# EAGLE design Interfacev2 (EAGLE 7.6.0)

## Sheet 1 of 3
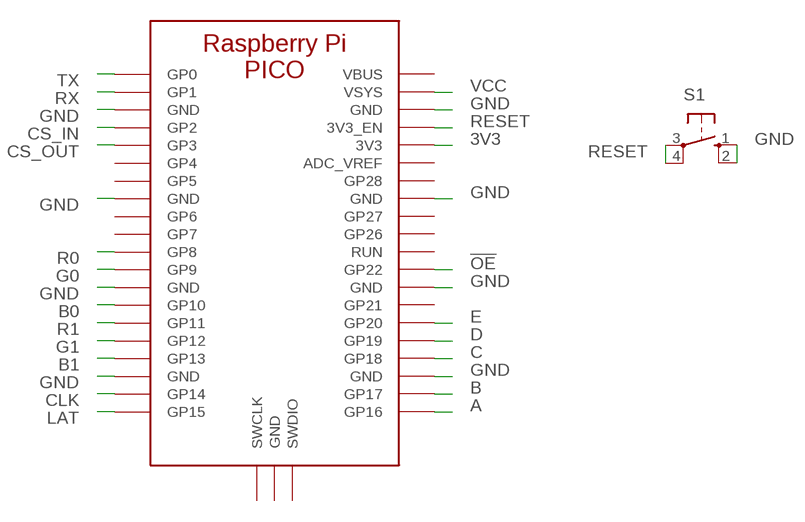
[diagram p0: schematic, sheet 1]

### Parts
S1  10-XX  [B3F-10XX]
U$1  PICO  [PICO]

### Nets
3V3: U$1.P$3V3(3V3) ; also sheet 2
!OE: U$1.P$GP22(GP22) ; also sheet 3
A: U$1.P$GP16(GP16) ; also sheet 3
B: U$1.P$GP17(GP17) ; also sheet 3
B0: U$1.P$GP10(GP10) ; also sheet 3
B1: U$1.P$GP13(GP13) ; also sheet 3
C: U$1.P$GP18(GP18) ; also sheet 3
CLK: U$1.P$GP14(GP14) ; also sheet 3
CS_IN: U$1.P$GP2(GP2) ; also sheet 2
CS_OUT: U$1.P$GP3(GP3) ; also sheet 2
D: U$1.P$GP19(GP19) ; also sheet 3
E: U$1.P$GP20(GP20) ; also sheet 3
G0: U$1.P$GP9(GP9) ; also sheet 3
G1: U$1.P$GP12(GP12) ; also sheet 3
GND: S1.1(S) S1.2(S1) U$1.P$GND3(GND) U$1.P$GND8(GND) U$1.P$GND13(GND) U$1.P$GND18(GND) U$1.P$GND23(GND) U$1.P$GND28(GND) U$1.P$GND33(GND) U$1.P$GND38(GND) ; also sheet 2,3
LAT: U$1.P$GP15(GP15) ; also sheet 3
R0: U$1.P$GP8(GP8) ; also sheet 3
R1: U$1.P$GP11(GP11) ; also sheet 3
RESET: S1.3(P) S1.4(P1) U$1.P$3V3_EN(3V3_EN)
RX: U$1.P$GP1(GP1) ; also sheet 2
TX: U$1.P$GP0(GP0) ; also sheet 2
VCC: U$1.P$VSYNC(VSYS) ; also sheet 3
Unconnected: U$1.P$GP4(GP4) U$1.P$GP5(GP5) U$1.P$GP6(GP6) U$1.P$GP7(GP7) U$1.P$GP21(GP21) U$1.P$GP26(GP26) U$1.P$GP27(GP27) U$1.P$GP28(GP28) U$1.P$RUN(RUN) U$1.P$SWCLK(SWCLK) U$1.P$SWDIO(SWDIO)

## Sheet 2 of 3
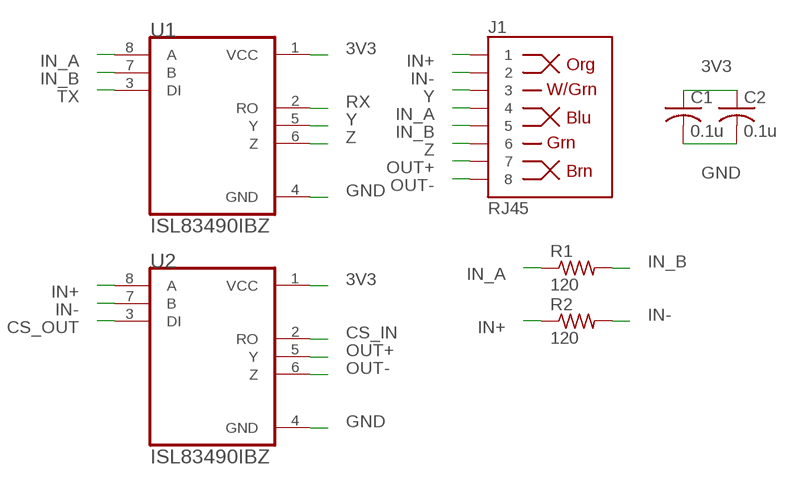
[diagram p1: schematic, sheet 2]

### Parts
C1  0.1u  C-USC0603  [C0603]
C2  0.1u  C-USC0603  [C0603]
J1  RJ45  RJ45-8PTH  [RJ45-8]
R1  120  R-US_R0603  [R0603]
R2  120  R-US_R0603  [R0603]
U1  ISL83490IBZ  [SOIC127P600X175-8N]
U2  ISL83490IBZ  [SOIC127P600X175-8N]

### Nets
3V3: C1.1 C2.1 U1.1(VCC) U2.1(VCC) ; also sheet 1
CS_IN: U2.2(RO) ; also sheet 1
CS_OUT: U2.3(DI) ; also sheet 1
GND: C1.2 C2.2 U1.4(GND) U2.4(GND) ; also sheet 1,3
IN+: J1.1 R2.1 U2.8(A)
IN-: J1.2 R2.2 U2.7(B)
IN_A: J1.4 R1.1 U1.8(A)
IN_B: J1.5 R1.2 U1.7(B)
OUT+: J1.7 U2.5(Y)
OUT-: J1.8 U2.6(Z)
RX: U1.2(RO) ; also sheet 1
TX: U1.3(DI) ; also sheet 1
Y: J1.3 U1.5(Y)
Z: J1.6 U1.6(Z)

## Sheet 3 of 3
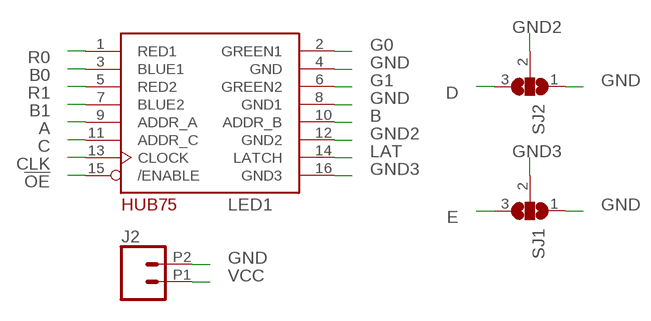
[diagram p2: schematic, sheet 3]

### Parts
J2  CONN_022.54MM_SCREWTERM  [1X02_2.54_SCREWTERM]
LED1  HUB75MATRIX  [2X08-IDC]
SJ1  SJ2W  [SJ_2]
SJ2  SJ2W  [SJ_2]

### Nets
!OE: LED1.15(/ENABLE) ; also sheet 1
A: LED1.9(ADDR_A) ; also sheet 1
B: LED1.10(ADDR_B) ; also sheet 1
B0: LED1.3(BLUE1) ; also sheet 1
B1: LED1.7(BLUE2) ; also sheet 1
C: LED1.11(ADDR_C) ; also sheet 1
CLK: LED1.13(CLOCK) ; also sheet 1
D: SJ2.3 ; also sheet 1
E: SJ1.3 ; also sheet 1
G0: LED1.2(GREEN1) ; also sheet 1
G1: LED1.6(GREEN2) ; also sheet 1
GND: J2.P2 LED1.4(GND) LED1.8(GND1) SJ1.1 SJ2.1 ; also sheet 1,2
GND2: LED1.12(GND2) SJ2.2
GND3: LED1.16(GND3) SJ1.2
LAT: LED1.14(LATCH) ; also sheet 1
R0: LED1.1(RED1) ; also sheet 1
R1: LED1.5(RED2) ; also sheet 1
VCC: J2.P1 ; also sheet 1

## Power pins joined to a net without a drawn wire
ADC_VREF: U$1.P$ADC_VREF(ADC_VREF)
GND: U$1.P$GND(GND)
VBUS: U$1.P$VBUS(VBUS)

## Library data of the parts
C1 C2 = rcl:C-US: CAPACITOR, American symbol
J1 = SparkFun-Connectors:RJ45-8: RJ45 Jack Simple RJ45, 8-pin connection - connector for common Cat5, Cat5e, and Cat6 Ethernet cables. Footprint not yet proven in production. Connector sku is PRT-00643; Breakout PCB sku is BOB-00716.; PROD_ID: CONN-08506
J2 = SparkFun-Connectors:CONN_02: Multi connection point. Often used as Generic Header-pin footprint for 0.1 inch spaced/style header connections On any of the 0.1 inch spaced packages, you can populate with these: Break Away Headers - Straight <https://www.sparkfun.com/products/116> (PRT-00116) Break Away Male Headers - Right Angle <https://www.sparkfun.com/products/553> (PRT-00553) Female Headers <https://www.sparkfun.com/products/115> (PRT-00115) Break Away Headers - Machine Pin <https://www.sparkfun.com/products/117> (PRT-00117) Break Away Female Headers - Swiss Machine Pin <https://www.sparkfun.com/products/743> (PRT-00743) For SCREWTERMINALS and SPRING TERMINALS visit here: Screw Terimnals on SparkFun.com <https://www.sparkfun.com/search/results?term=Screw+Terminals> (5mm/3.5mm/2.54mm spacing) This device is also useful as a general connection point to wire up your design to another part of your project. Our various solder wires solder well into these plated through hole pads. Hook-Up Wire - Assortment (Stranded, 22 AWG) <https://www.sparkfun.com/products/11375> (PRT-11375) Hook-Up Wire - Assortment (Solid Core, 22 AWG) <https://www.sparkfun.com/products/11367> (PRT-11367) View the entire wire category on our website here <https://www.sparkfun.com/categories/141> Special notes: Molex polarized connector foot print use with: PRT-08233 with associated crimp pins and housings. 2.54_SCREWTERM for use with PRT-10571. 3.5mm Screw Terminal footprints for PRT-08084 5mm Screw Terminal footprints for use with PRT-08432
LED1 = adafruit:HUB75MATRIX
R1 R2 = rcl:R-US_: RESISTOR, American symbol
S1 = switch-omron:10-XX: OMRON SWITCH; MPN: B3F-1000; OC_FARNELL: 176432; OC_NEWARK: 36M3542
SJ1 SJ2 = jumper:SJ2W: SMD solder JUMPER
U1 U2 = ISL83490IBZ:ISL83490IBZ: None; DESCRIPTION: ISL83490 Series 3.6 V 10 Mbps Low Power High Speed RS-485/RS-422 Transceiver; DIGI-KEY_PART_NUMBER: ISL83490IBZ-TCT-ND; DIGI-KEY_PURCHASE_URL: https://www.digikey.com/product-detail/en/renesas-electronics-america-inc/ISL83490IBZ-T/ISL83490IBZ-TCT-ND/3603227?utm_source=snapeda&utm_medium=aggregator&utm_campaign=symbol; MF: Renesas Electronics; MP: ISL83490IBZ-T; PACKAGE: SOIC-8 Intersil
U$1 = Raspberry_Pi_Pico:PICO

## Board
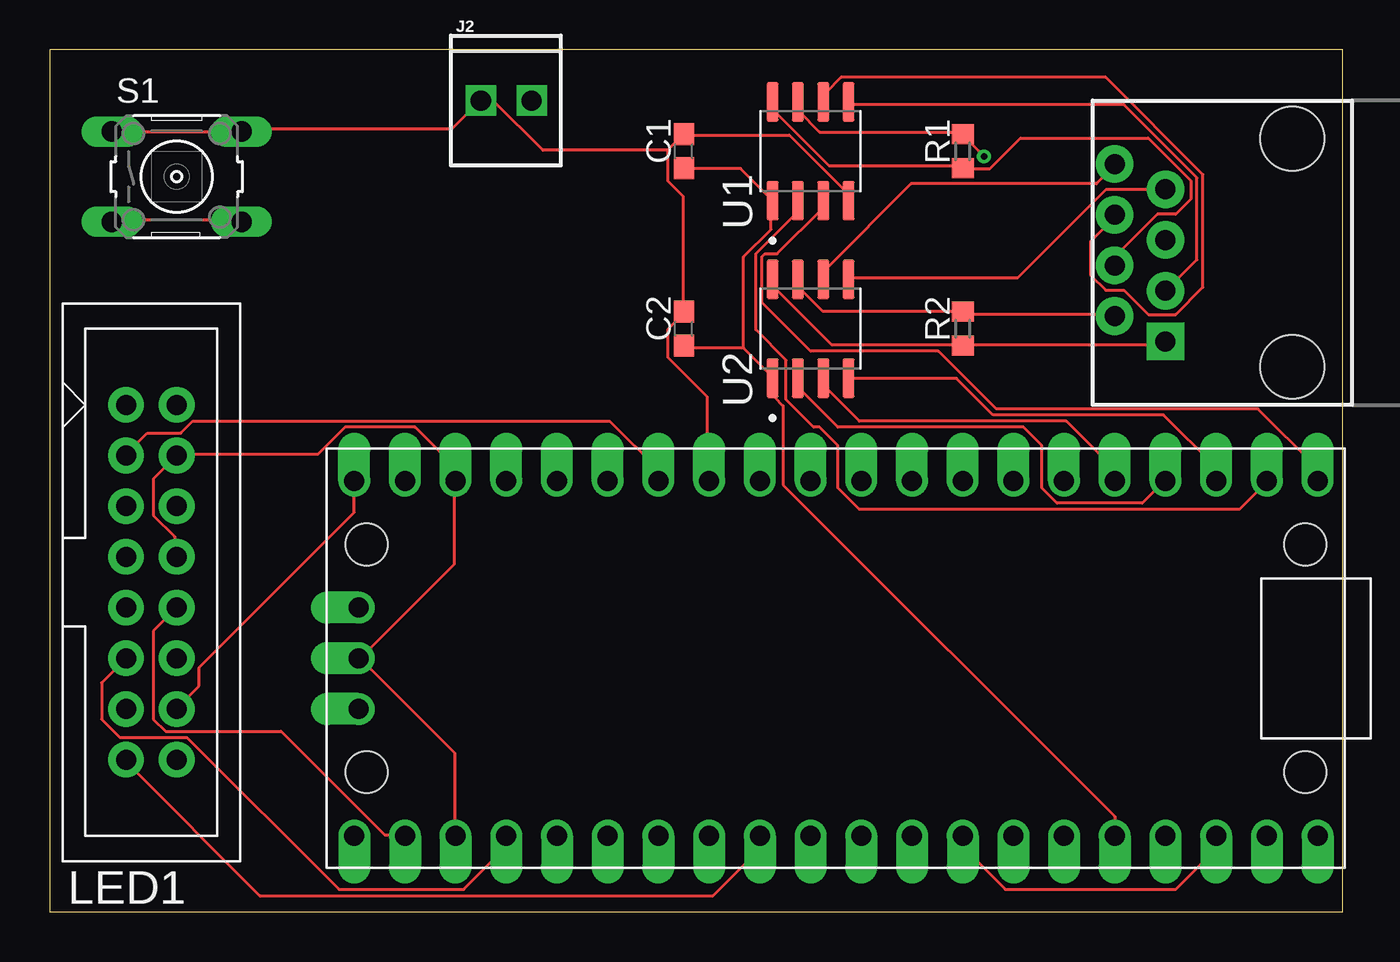
[diagram p3: board, top side]
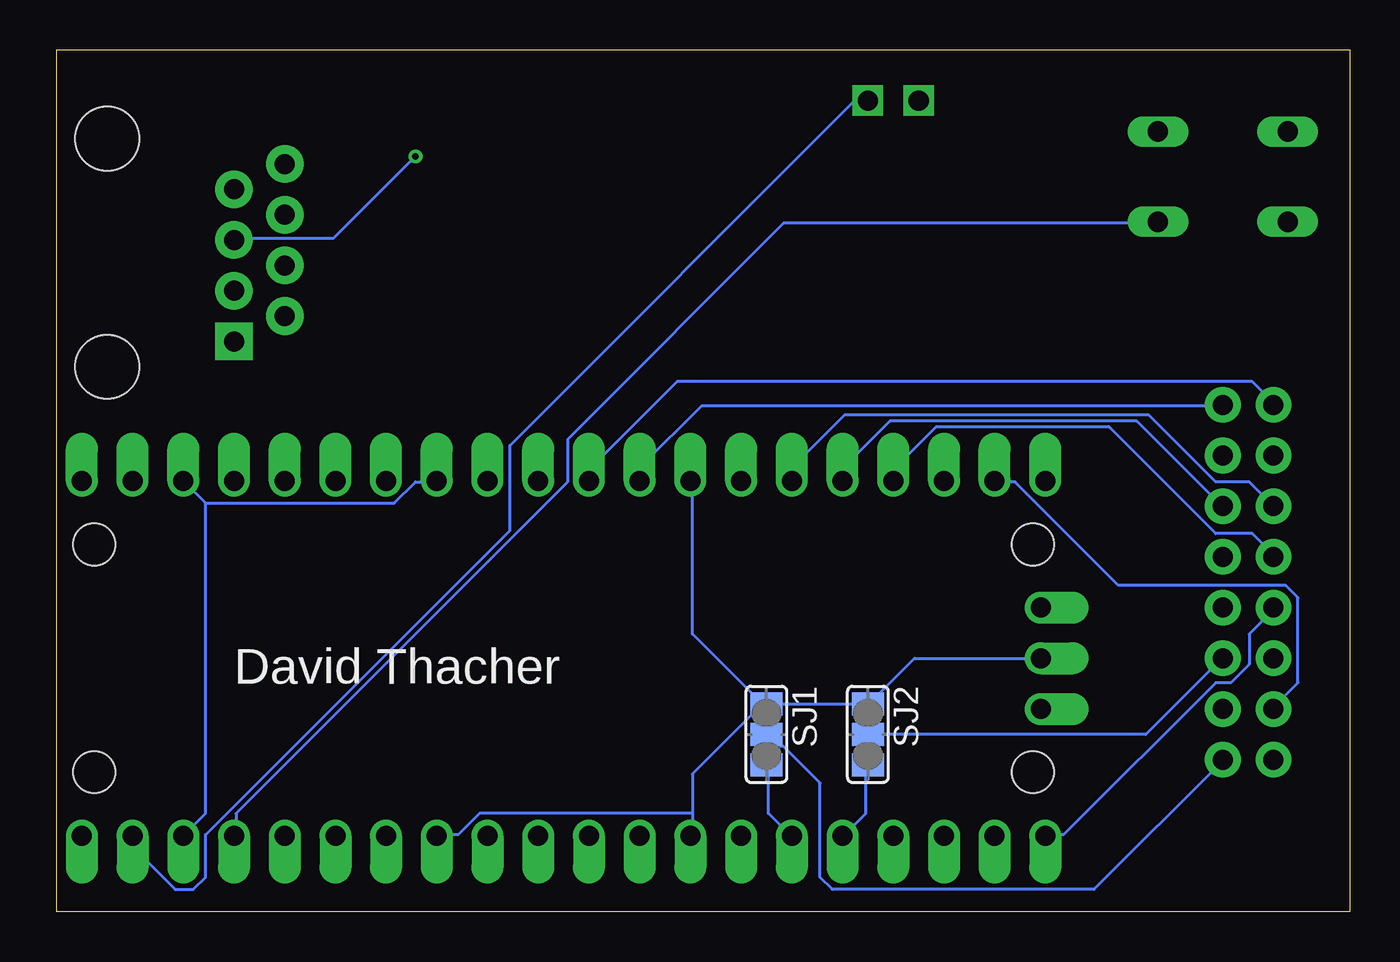
[diagram p4: board, bottom side, seen from below]

Size 64.77 x 43.18 mm. Coordinates in mm from the lower left corner, seen from the top.
Outline: 0,0 64.77,0 64.77,43.18 0,43.18 0,0
Copper layers (1*16): Top 0.0356mm / dielectric 1.5011mm / Bottom 0.0356mm
Design rules "oshpark-2layer": minimum track width 6mil, minimum drill 13mil, track to track 6mil, track to pad 6mil, pad to pad 6mil, via to via 6mil, smd to smd 6mil, copper to edge 15mil, drill to drill 6mil, minimum pad ring 7mil, minimum via ring 7mil, stop-mask expansion 2.5mil, vias tented up to drill 0mil, thermal gap 10mil

### Footprints (pad centres in the part's own frame; a part is rotated, then mirrored left to right if it is on the bottom)
C0603 = smd 1.1 x 1: 1 -0.85,0; 2 0.85,0
RJ45-8 = drill 1 pad 1.88 square: 1 -4.445,6.35 | drill 1 pad 1.88: 2 -3.175,8.89; 3 -1.905,6.35; 4 -0.635,8.89; 5 0.635,6.35; 6 1.905,8.89; 7 3.175,6.35; 8 4.445,8.89 | hole 3.2: -5.715,0; 5.715,0
1X02_2.54_SCREWTERM = drill 1.016 square: P1 2.54,0; P2 0,0
2X08-IDC = drill 1 pad 1.778: 1 -1.27,8.89; 2 1.27,8.89; 3 -1.27,6.35; 4 1.27,6.35; 5 -1.27,3.81; 6 1.27,3.81; 7 -1.27,1.27; 8 1.27,1.27; 9 -1.27,-1.27; 10 1.27,-1.27; 11 -1.27,-3.81; 12 1.27,-3.81; 13 -1.27,-6.35; 14 1.27,-6.35; 15 -1.27,-8.89; 16 1.27,-8.89
R0603 = smd 1 x 1.1: 1 -0.85,0; 2 0.85,0
B3F-10XX = drill 1.016 long: 1 -3.251,2.261; 2 3.251,2.261; 3 -3.251,-2.261; 4 3.251,-2.261
SJ_2 = smd 1.168 x 1.6: 1 -1.524,0; 2 0,0; 3 1.524,0
SOIC127P600X175-8N = smd 1.97 x 0.6: 1 -2.475,1.905; 2 -2.475,0.635; 3 -2.475,-0.635; 4 -2.475,-1.905; 5 2.475,-1.905; 6 2.475,-0.635; 7 2.475,0.635; 8 2.475,1.905
PICO = drill 1 pad 1.6 offset: P$3V3 8.89,13.97; P$3V3_EN 8.89,16.51; P$ADC_VREF 8.89,11.43; P$GND 0,-23.9; P$GND3 -8.89,19.05; P$GND8 -8.89,6.35; P$GND13 -8.89,-6.35; P$GND18 -8.89,-19.05; P$GND23 8.89,-19.05; P$GND28 8.89,-6.35; P$GND33 8.89,6.35; P$GND38 8.89,19.05; P$GP0 -8.89,24.13; P$GP1 -8.89,21.59; P$GP2 -8.89,16.51; P$GP3 -8.89,13.97; P$GP4 -8.89,11.43; P$GP5 -8.89,8.89; P$GP6 -8.89,3.81; P$GP7 -8.89,1.27; P$GP8 -8.89,-1.27; P$GP9 -8.89,-3.81; P$GP10 -8.89,-8.89; P$GP11 -8.89,-11.43; P$GP12 -8.89,-13.97; P$GP13 -8.89,-16.51; P$GP14 -8.89,-21.59; P$GP15 -8.89,-24.13; P$GP16 8.89,-24.13; P$GP17 8.89,-21.59; P$GP18 8.89,-16.51; P$GP19 8.89,-13.97; P$GP20 8.89,-11.43; P$GP21 8.89,-8.89; P$GP22 8.89,-3.81; P$GP26 8.89,1.27; P$GP27 8.89,3.81; P$GP28 8.89,8.89; P$RUN 8.89,-1.27; P$SWCLK -2.54,-23.9; P$SWDIO 2.54,-23.9; P$VBUS 8.89,24.13; P$VSYNC 8.89,21.59 | hole 2.1: -5.7,-23.5; 5.7,-23.5; 5.7,23.5; -5.7,23.5

### Placement (x,y rotation side)
C1  31.75,38.1 90 top
C2  31.75,29.21 90 top
J1  62.23,33.02 90 top
J2  21.59,40.64 0 top
LED1  5.08,16.51 0 top
R1  45.72,38.1 90 top
R2  45.72,29.21 90 top
S1  6.35,36.83 0 top
SJ1  29.21,8.89 270 bottom
SJ2  24.13,8.89 270 bottom
U1  38.1,38.1 90 top
U2  38.1,29.21 90 top
U$1  39.37,12.7 270 top

### Tracks (layer width: path | path; a pad name or v marks a point on that pad's centre or on a via)
3V3
  Top 0.152: C1.1 31.85,37.24 34.59,37.24 36.12,35.71 U1.1 36.12,35.56 36.12,34.19 34.75,32.82 34.75,28.24 | 34.75,28.24 31.85,28.24 C2.1 | 34.75,28.24 36.12,26.87 U2.1 36.27,26.72 36.27,25.81 36.73,25.35 36.73,21.39 53.34,4.77 U$1.P$3V3
!OE
  Top 0.152: U$1.P$GP22 35.51,3.71 35.51,3.1 33.22,0.81 10.52,0.81 3.81,7.52 LED1.15
A
  Bottom 0.152: U$1.P$GP16 15.24,3.86 14.33,3.86 6.71,11.48 5.94,11.48 5.03,12.39 5.03,13.92 3.81,15.14 LED1.9
B
  Top 0.152: LED1.10 5.18,14.07 5.18,9.65 5.79,9.04 11.58,9.04 16.76,3.86 17.68,3.86 U$1.P$GP17
B0
  Top 0.152: U$1.P$GP10 30.48,22.15 28.04,24.59 7.16,24.59 6.55,23.98 4.88,23.98 3.81,22.91 LED1.3
B1
  Bottom 0.152: U$1.P$GP13 22.86,22.15 20.73,24.28 12.04,24.28 6.71,18.95 4.88,18.95 3.81,17.88 LED1.7
C
  Top 0.152: U$1.P$GP18 22.86,3.25 20.73,1.12 14.48,1.12 6.86,8.74 3.5,8.74 2.59,9.65 2.59,11.48 LED1.11
CLK
  Bottom 0.152: U$1.P$GP14 17.68,21.54 16.76,21.54 11.58,16.36 3.2,16.36 2.59,15.75 2.59,11.48 3.81,10.26 LED1.13
CS_IN
  Top 0.152: U2.2 37.49,26.72 37.49,26.26 39.47,24.28 48.77,24.28 49.68,23.37 49.68,21.23 50.44,20.47 54.71,20.47 55.78,21.54 U$1.P$GP2
CS_OUT
  Top 0.152: U$1.P$GP3 53.34,22.15 50.9,24.59 40.54,24.59 38.86,26.26 38.86,26.72 U2.3
D
  Bottom 0.152: SJ2.3 24.23,7.37 24.23,4.93 25.3,3.86 U$1.P$GP19
E
  Bottom 0.152: SJ1.3 29.11,7.37 29.11,4.93 28.04,3.86 U$1.P$GP20
G0
  Bottom 0.152: U$1.P$GP9 35.51,21.69 35.51,22.3 32.46,25.35 6.4,25.35 LED1.2
G1
  Bottom 0.152: U$1.P$GP12 25.3,21.69 25.3,22.3 23.01,24.59 10.67,24.59 6.4,20.32 LED1.6
GND
  Top 0.152: S1.1 3.2,39.06 9.6,39.06 S1.2 9.6,39.22 20.12,39.22 21.49,40.59 J2.P2 21.64,40.59 22.25,40.59 24.69,38.15 30.94,38.15 | 30.94,38.15 30.94,36.63 31.7,35.87 31.7,30.07 C2.2 31.7,29.92 30.94,29.16 30.94,27.79 32.92,25.81 32.92,21.69 U$1.P$GND13 | 30.94,38.15 31.7,38.91 C1.2 31.85,38.91 37.03,38.91 39.93,36.02 39.93,35.71 U1.4 | LED1.8 6.25,17.88 6.25,18.8 5.18,19.86 5.18,21.69 LED1.4 6.4,22.91 13.41,22.91 14.78,24.28 18.29,24.28 20.27,22.3 20.27,21.69 U$1.P$GND18 20.27,21.54 20.27,17.42 15.54,12.7 | 15.54,12.7 20.27,7.98 20.27,3.86 U$1.P$GND23 | 15.54,12.7 U$1.P$GND | U2.4 40.08,26.72 45.41,26.72 47.24,24.89 55.78,24.89 58.37,22.3 58.37,21.69 U$1.P$GND3 | U$1.P$GND33 45.72,3.25 47.85,1.12 56.39,1.12 58.37,3.1 58.37,3.71 U$1.P$GND38
  Bottom 0.152: 57.3,20.47 47.85,20.47 46.79,21.54 45.72,21.54 U$1.P$GND8 | U$1.P$GND3 57.3,20.47 | SJ1.1 SJ2.1 24.08,10.41 21.79,12.7 U$1.P$GND | 32.92,4.93 32.92,6.91 29.41,10.41 | 32.92,4.93 32.92,3.86 U$1.P$GND28 | SJ1.1 29.41,10.41 | 32.92,4.93 43.59,4.93 44.65,3.86 45.72,3.86 U$1.P$GND33 | 57.3,20.47 57.3,4.93 U$1.P$GND38 | 29.41,10.41 32.92,13.92 32.92,21.54 U$1.P$GND13 | 29.26,10.41 SJ1.1
GND2
  Bottom 0.152: SJ2.2 10.21,8.89 6.4,12.7 LED1.12
GND3
  Bottom 0.152: SJ1.2 29.11,8.89 28.5,8.28 28.35,8.28 26.52,6.45 26.52,1.73 25.91,1.12 12.8,1.12 6.4,7.52 LED1.16
IN+
  Top 0.152: 45.72,28.4 55.63,28.4 55.78,28.55 J1.1 | 45.72,28.4 39.17,28.4 36.27,31.29 36.27,31.6 U2.8 | 45.72,28.4 R2.1
IN-
  Top 0.152: J1.2 53.34,29.92 45.72,29.92 R2.2 45.72,30.07 38.71,30.07 37.49,31.29 37.49,31.6 U2.7
IN_A
  Top 0.152: U1.8 36.27,40.44 36.27,40.13 39.01,37.39 45.72,37.39 R1.1 45.72,37.24 47.09,37.24 48.62,38.76 55.02,38.76 57.15,36.63 57.15,35.71 56.39,34.95 55.47,34.95 53.34,32.82 J1.4
IN_B  (via drill 0.33)
  Top 0.152: U1.7 37.49,40.44 37.49,40.13 38.56,39.06 45.72,39.06 R1.2 45.72,38.91 v46.79,37.85
  Bottom 0.152: v46.79,37.85 50.9,33.73 55.78,33.73 J1.5
LAT
  Top 0.152: U$1.P$GP15 15.24,20.02 7.47,12.24 7.47,11.33 6.4,10.26 LED1.14
OUT+
  Top 0.152: U2.5 40.08,31.75 48.46,31.75 52.88,36.17 55.78,36.17 J1.7
OUT-
  Top 0.152: U2.6 38.86,31.75 38.86,32.21 43.13,36.47 52.43,36.47 53.34,37.39 J1.8
R0
  Bottom 0.152: U$1.P$GP8 38.1,22.15 33.68,26.57 4.88,26.57 3.81,25.5 LED1.1
R1
  Bottom 0.152: LED1.5 5.03,21.54 6.71,21.54 10.06,24.89 25.3,24.89 27.89,22.3 27.89,21.69 U$1.P$GP11
RESET
  Top 0.152: S1.3 3.2,34.65 9.6,34.65 S1.4
  Bottom 0.152: U$1.P$3V3_EN 55.78,3.86 55.78,4.93 39.17,21.54 39.17,23.67 28.35,34.49 9.6,34.49 S1.4
RX
  Top 0.152: U1.2 37.34,35.56 37.34,34.95 35.36,32.97 35.36,29.16 36.88,27.63 36.88,25.65 38.25,24.28 38.56,24.28 39.47,23.37 39.47,21.23 40.54,20.17 59.59,20.17 60.96,21.54 U$1.P$GP1
TX
  Top 0.152: U1.3 38.71,35.56 38.71,35.25 36.42,32.97 35.81,32.97 35.66,32.82 35.66,30.53 38.1,28.09 44.5,28.09 47.4,25.2 60.5,25.2 63.4,22.3 63.4,21.69 U$1.P$GP0
VCC
  Bottom 0.152: U$1.P$VSYNC 60.96,3.25 58.83,1.12 57.91,1.12 57.3,1.73 57.3,3.86 42.06,19.1 42.06,23.37 24.84,40.59 24.23,40.59 J2.P1
Y
  Top 0.152: U1.5 40.08,40.44 53.8,40.44 57.45,36.78 57.45,32.66 55.93,31.14 J1.3
Z
  Top 0.152: U1.6 38.86,40.59 38.86,41.05 39.62,41.81 52.88,41.81 57.76,36.93 57.76,31.29 56.39,29.92 55.02,29.92 53.8,31.14 52.88,31.14 52.12,31.9 52.12,33.58 53.34,34.8 J1.6

### Text on the board
bNames: David Thacher